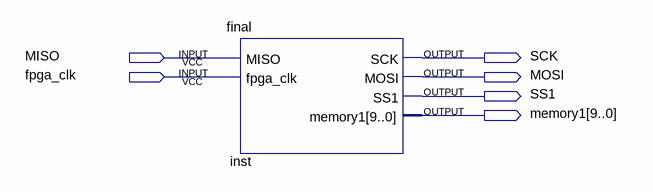
[diagram p0: schematic sheet]
// Quartus schematic Block1.bdf as structural Verilog: 1 symbols, 6 pins
module Block1 (
  input  MISO,
  input  fpga_clk,
  output SCK,
  output MOSI,
  output SS1,
  output [9:0] memory1
);

  \final  inst (.MISO(MISO), .fpga_clk(fpga_clk), .SCK(SCK), .MOSI(MOSI), .SS1(SS1), .memory1(memory1));
endmodule
